# EasyEDA Pro project ProDoc_pico-mac v2.0.epro

# Schematic pico-mac v2.0
Board Name: pico-mac v2.0; Create Date: 2025-06-08; Page Name: schematic; Project Name: pico-mac; Schematic Name: pico-mac v2.0; Update Date: 2025-06-14; Add into BOM: yes; Convert to PCB: yes; Date: 2025-05-04; Draw By: moepunch123; REV: 1.0; Sheet: 1/1; spicePre: .
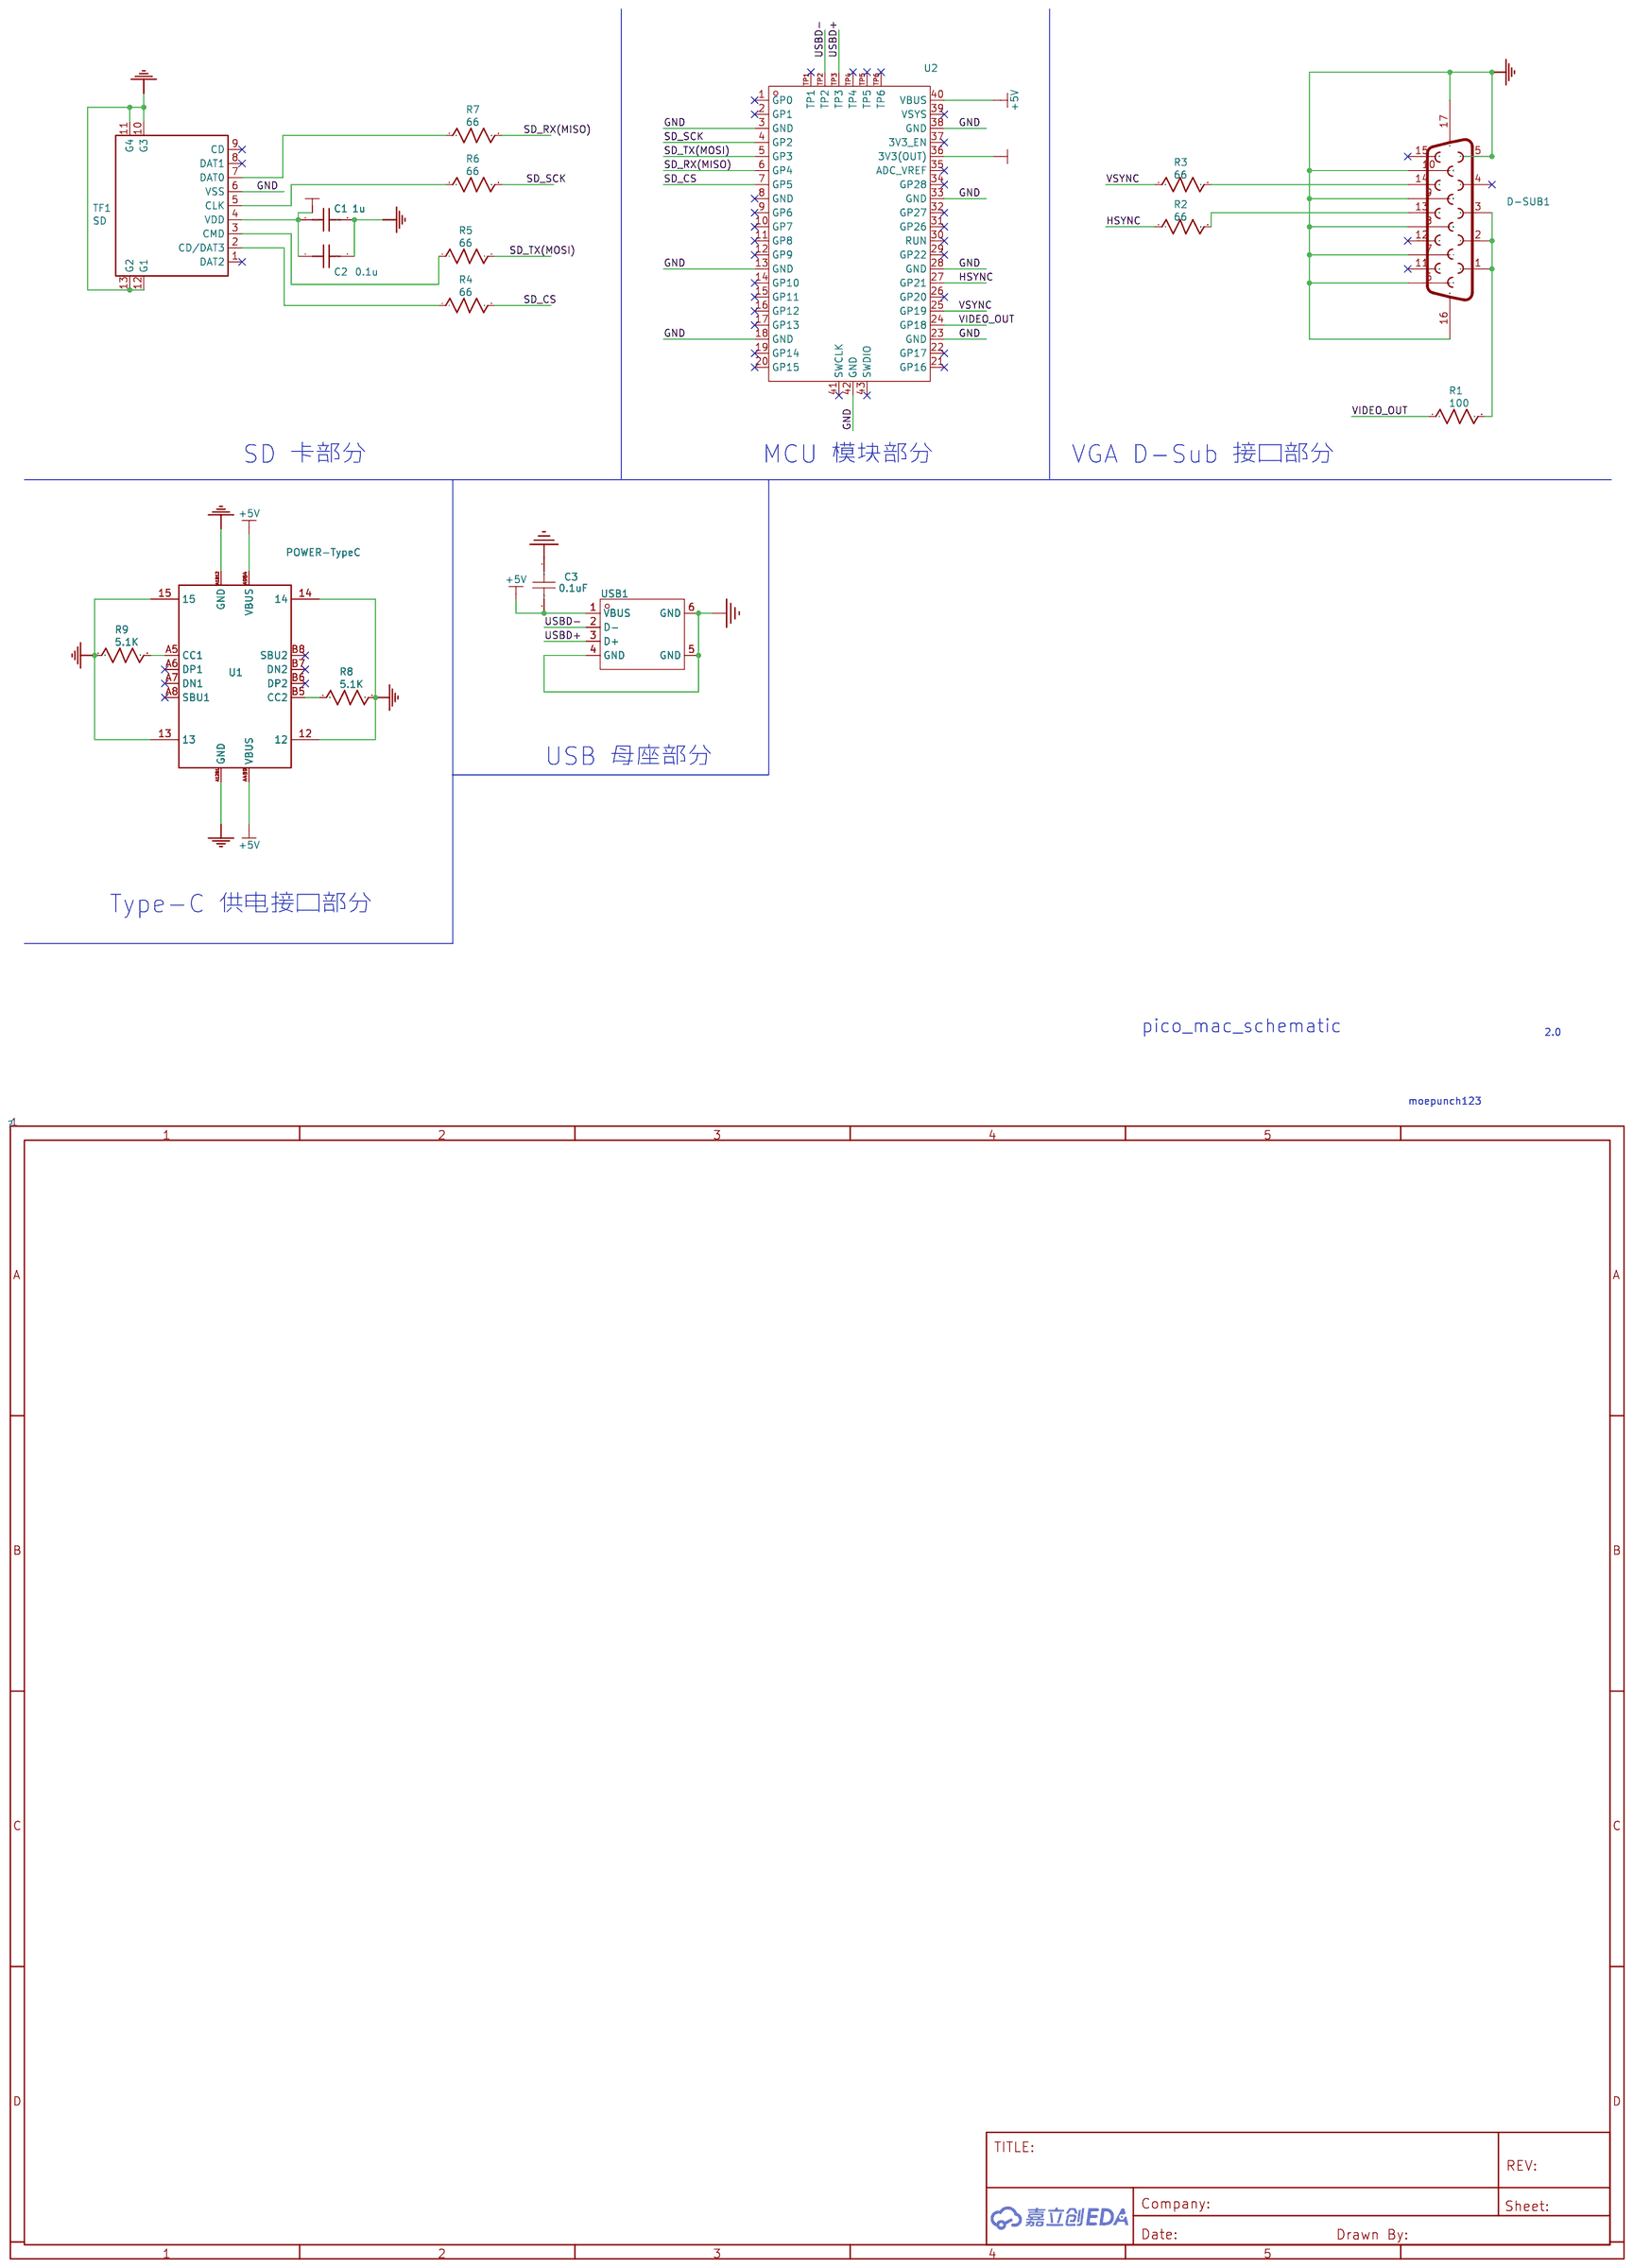
[diagram p0: schematic sheet]

## Parts
C1  1u  [C0603]
C2  0.1u  [C0603]
C3  0.1uF  [C0603]
D-SUB1  VGA  [DSUB-TH_KH-HDR15P-F3.08-VGA]
R1  100  [R0603]
R2  66  [R0603]
R3  66  [R0603]
R4  66  [R0603]
R5  66  [R0603]
R6  66  [R0603]
R7  66  [R0603]
R8  5.1K  [R0603]
R9  5.1K  [R0603]
TF1  SD  [TF-SMD_TF-15-15]
U1  POWER-TypeC  [USB-C-SMD_HC-TYPE-C-16P-026W]
U2  PICO  [COMM-SMD_L51.0-W21.0-P2.54_SC0916]
USB1  USB-231-ARY  [USB-A-TH_USB-231-ARY]

## Library data of the parts
C1 = 1u: nameAlias: Value(F); Contributor: LCEDA_Lib; spicePre: C; spiceSymbolName: C_0603_US
C2 = 0.1u: nameAlias: Value(F); Contributor: LCEDA_Lib; spicePre: C; spiceSymbolName: C_0603_US
C3 = CAP_0603: Supplier Footprint: 0603
D-SUB1 = VGA: Supplier: LCSC; Supplier Part: C3038673; Manufacturer: kinghelm(金航标); Manufacturer Part: KH-HDR15P-F3.08; Contributor: lcsc; spicePre: C; spiceSymbolName: KH-HDR15P-F3.08
R1 = 100: nameAlias: Value(Ω); Contributor: LCEDA_Lib; spicePre: R; spiceSymbolName: R_0603_US
R2-R7 = 66: nameAlias: Value(Ω); Contributor: LCEDA_Lib; spicePre: R; spiceSymbolName: R_0603_US
R8 R9 = 5.1K: nameAlias: Value(Ω); Contributor: LCEDA_Lib; spicePre: R; spiceSymbolName: R_0603_US
TF1 = SD: Supplier: LCSC; Supplier Part: C9900023771; Manufacturer: null; JLCPCB Part Class: Extended Part; Contributor: lcsc; spicePre: T
U1 = POWER-TypeC: Supplier: LCSC; Supplier Part: C19274016; Manufacturer: HC(虹成电子); Manufacturer Part: HC-TYPE-C-16P-3M2S; JLCPCB Part Class: Extended Part; Contributor: lcsc; spicePre: U; spiceSymbolName: HC-TYPE-C-16P-3M2S
U2 = PICO: "基于Raspberry Pi RP2040芯片设计；处理器：双核Arm Cortex-M0+ @ 133MHz内存：264KB片上SRAM；2MB板上QSPI闪存接口：26个GPIO引脚，包括3个模拟输入；2 × UART；2 × SPI控制器；2 × I2C控制器；16个PWM通道；1 × USB 1.1控制器和PHY，支持主机和设备；8 × PIO状态机"; Supplier Part: C7203002; Manufacturer: Raspberry Pi(树莓派); JLCPCB Part Class: 扩展库; Datasheet: https://atta.szlcsc.com/upload/public/pdf/source/20230906/086376002DDC9866828648BC93E51F8B.pdf; Supplier: LCSC
USB1 = USB-231-ARY: 连接器类型:Type-A;标准:USB 2.0;公母:母;端口数量:1;触点数量:4P;安装方式:弯插;额定电流 - 电源:1.5A;触头材质:-;触头镀层:-;工作温度范围:-20℃~+70℃;焊接温度(最大值):260℃;; LCSC Part Name: Type-A 母 弯插; Supplier Part: C720525; Manufacturer: XUNPU(讯普); Supplier Footprint: 插件; JLCPCB Part Class: 扩展库; Datasheet: https://atta.szlcsc.com/upload/public/pdf/source/20200810/C720525_A4C9C15D608FF9239C9C137FD959DB52.pdf; Supplier: LCSC; Connector Type: Type-A; Standard: USB 2.0; Gender: 母; Number of Ports: 1; Number of Contacts: 4P; Mounting Style: 弯插; Current Rating - Power (Max): 1.5A; Operating Temperature Range: -20℃~+70℃; Soldering Temperature(Max): 260℃

## Nets
+3.3V: C1.1 C2.1 TF1.4(VDD) U2.36(3V3(OUT))
+5V: C3.2 U1.A4B9(VBUS) U1.A9B4(VBUS) U2.40(VBUS) USB1.1(VBUS)
GND: C1.2 C2.2 C3.1 D-SUB1.5 D-SUB1.6 D-SUB1.7 D-SUB1.8 D-SUB1.9 D-SUB1.10 D-SUB1.16 D-SUB1.17 R8.2 R9.1 TF1.6(VSS) TF1.10(G3) TF1.11(G4) TF1.12(G1) TF1.13(G2) U1.12 U1.13 U1.14 U1.15 U1.A1B12(GND) U1.A12B1(GND) U2.3(GND) U2.13(GND) U2.18(GND) U2.23(GND) U2.28(GND) U2.33(GND) U2.38(GND) U2.42(GND) USB1.4(GND) USB1.5(GND) USB1.6(GND)
HSYNC: R2.1 U2.27(GP21)
SD_CS: R4.2 U2.7(GP5)
SD_RX(MISO): R7.2 U2.6(GP4)
SD_SCK: R6.2 U2.4(GP2)
SD_TX(MOSI): R5.2 U2.5(GP3)
USBD+: U2.TP3 USB1.3(D+)
USBD-: U2.TP2 USB1.2(D-)
VIDEO_OUT: R1.1 U2.24(GP18)
VSYNC: R3.1 U2.25(GP19)
$1N2: D-SUB1.1 D-SUB1.2 D-SUB1.3 R1.2
$1N4: D-SUB1.14 R3.2
$1N6: D-SUB1.13 R2.2
$1N12: R6.1 TF1.5(CLK)
$1N15: R5.1 TF1.3(CMD)
$1N17: R4.1 TF1.2(CD/DAT3)
$1N22: R9.2 U1.A5(CC1)
$1N23: R8.1 U1.B5(CC2)
$1N3252: R7.1 TF1.7(DAT0)

Not connected (* = marked no-connect by the designer): D-SUB1 4* 11* 12* 15*; TF1 1(DAT2)* 8(DAT1)* 9(CD)*; U1 A6(DP1)* A7(DN1)* A8(SBU1)* B6(DP2)* B7(DN2)* B8(SBU2)*; U2 1(GP0)* 2(GP1)* 8(GND)* 9(GP6)* 10(GP7)* 11(GP8)* 12(GP9)* 14(GP10)* 15(GP11)* 16(GP12)* 17(GP13)* 19(GP14)* 20(GP15)* 21(GP16)* 22(GP17)* 26(GP20)* 29(GP22)* 30(RUN)* 31(GP26)* 32(GP27)* 34(GP28)* 35(ADC_VREF)* 37(3V3_EN)* 39(VSYS)* 41(SWCLK)* 43(SWDIO)* TP1* TP4* TP5* TP6*

## Notes on the sheet
- SD 卡部分
- MCU 模块部分
- VGA D-Sub 接口部分
- USB 母座部分
- Type-C 供电接口部分
- pico_mac_schematic
- 2.0
- moepunch123

# Board PCB_pico-mac_v2.0
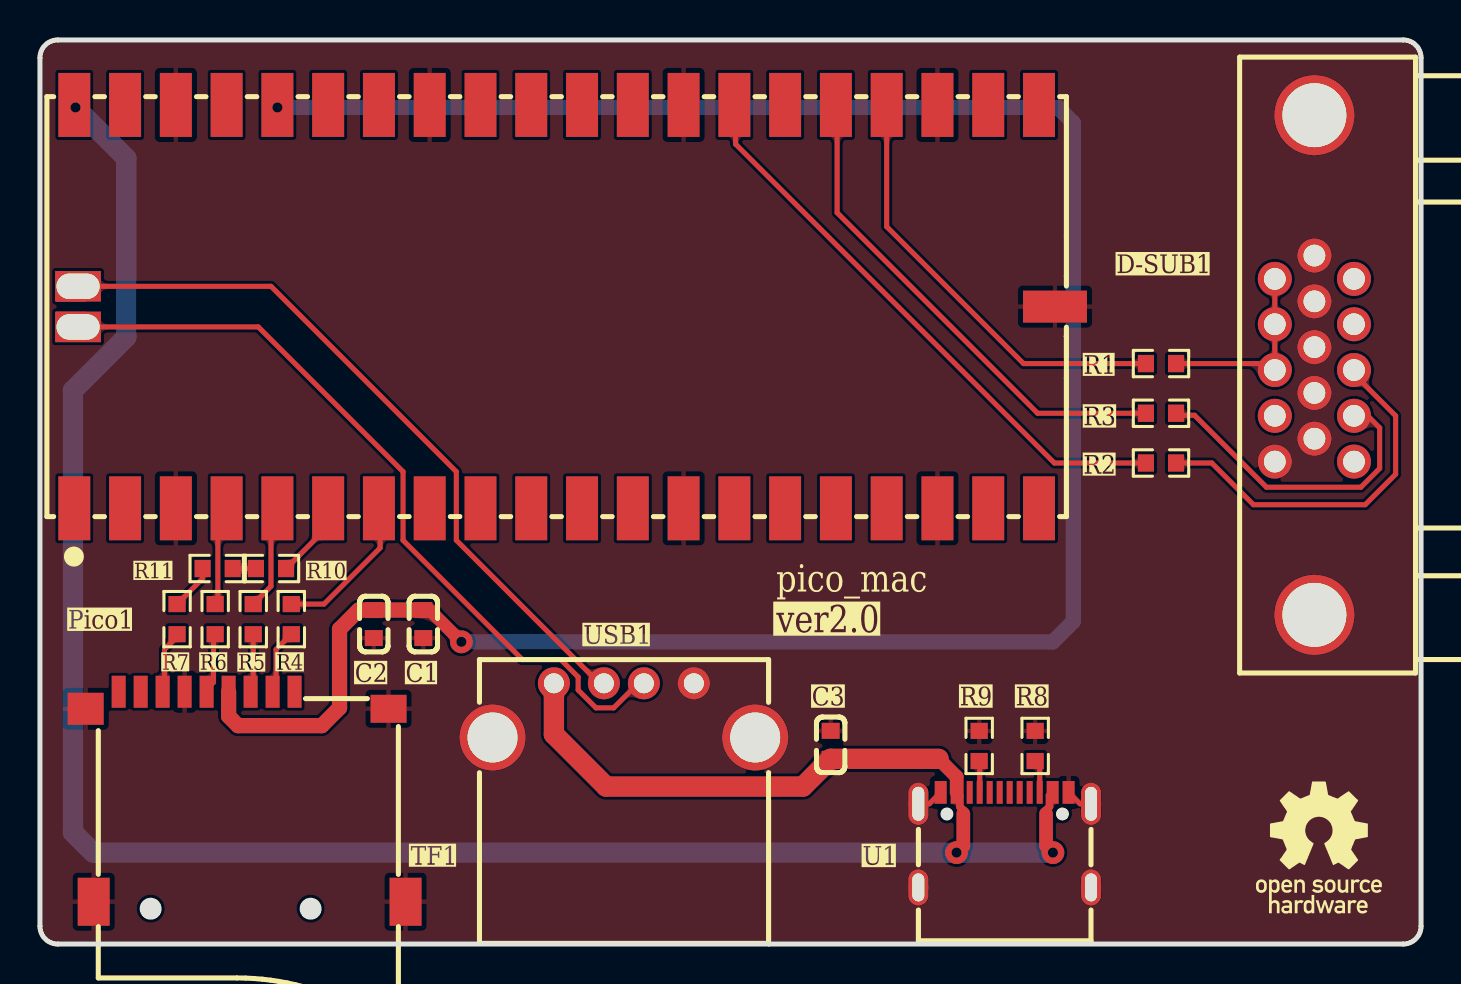
[diagram p1: board, top side]
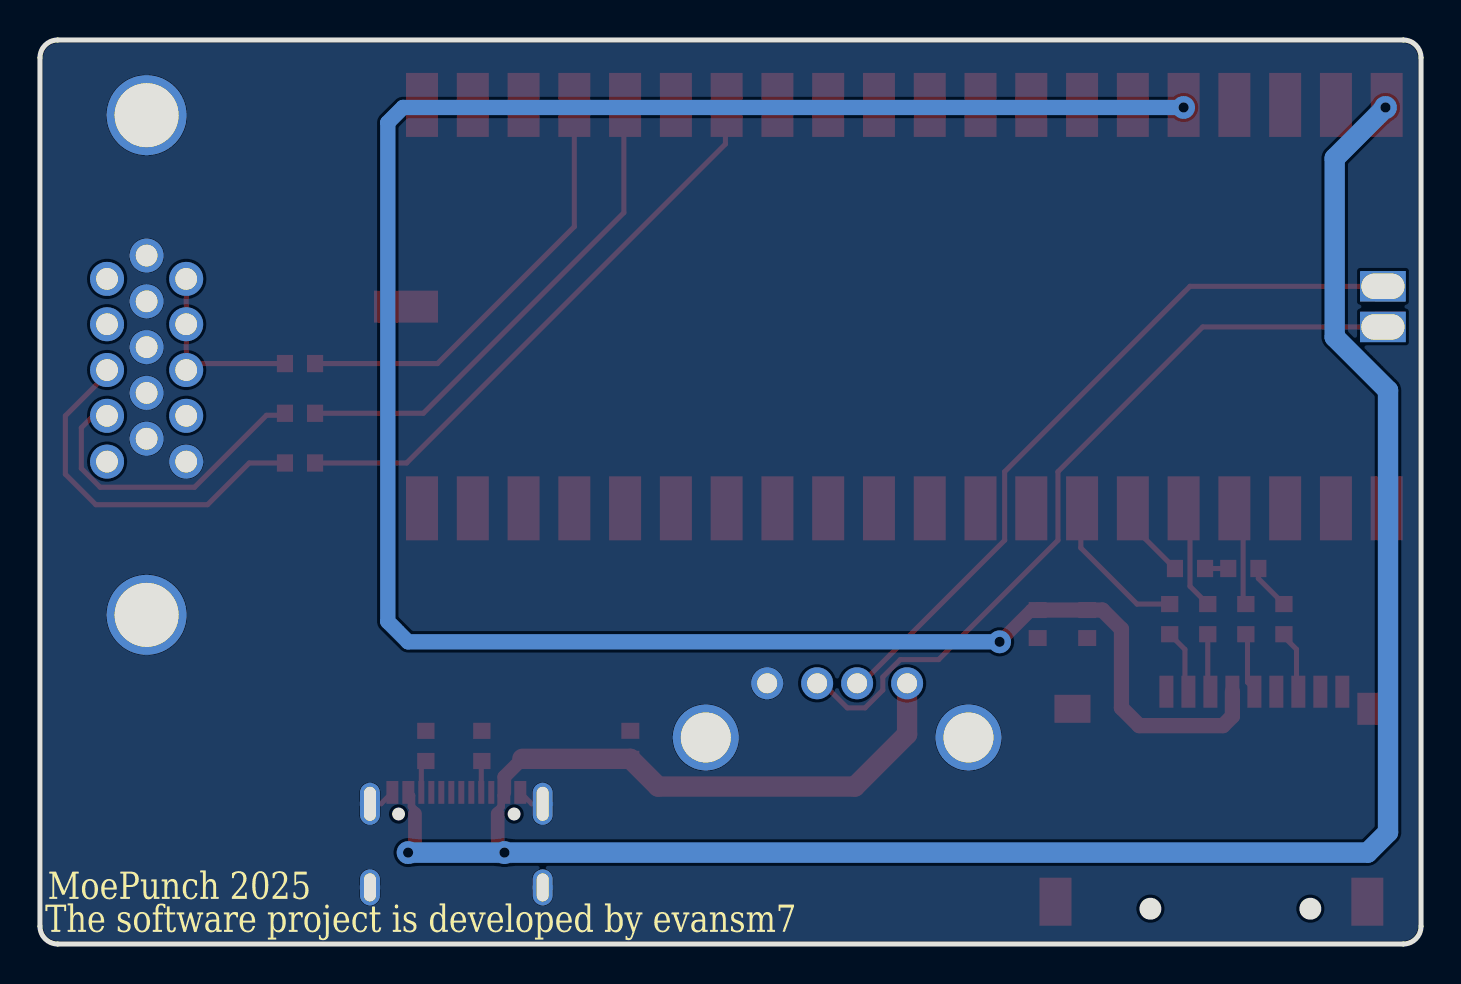
[diagram p2: board, bottom side, seen from below]

Outline 69.09 x 45.21 mm; copper layers: Top Layer, Bottom Layer. Coordinates in mm from the lower left corner of the outline.
Outline path: 0,44.32 0,0.89 arc(0.26,0.26) 0.89,0 68.2,0 arc(68.83,0.26) 69.09,0.89 69.09,44.32 arc(68.83,44.95) 68.2,45.21 0.89,45.21 arc(0.26,44.95) 0,44.32
Stack: Top Layer 0.035mm / Dielectric1 1.51mm FR4 er 4.5 / Bottom Layer 0.035mm

## Design rules (mm)
spacing Default (default): track to track 0.152, other pairs 0 to 0.152
track width Default (default): min 0.254, default 0.254, max 25.4
differential pair differentialPair (default): width min 0.127, default 0.254, max 2.54; gap min 0.152, default 0.152
via Default (default): diameter min 0.61, default 0.61, max 100.025; hole min 0.305, default 0.305, max 59.995

## Placement (name value [footprint] x y rotation side)
C1  1u  [C0603]  19.18 16 270 top
C2  0.1u  [C0603]  16.7 16 270 top
C3  0.1uF  [C0603]  39.55 9.96 270 top
D-SUB1  VGA  [DSUB-TH_KH-HDR15P-F3.08-VGA]  63.75 28.96 90 top
NOREF  -  [Pad_e638]  1.91 30.86 0 top
NOREF#2  -  [Pad_e636]  1.91 32.89 0 top
Pico1  PICO  [COMM-SMD_L51.0-W21.0-P2.54_SC0916]  26.16 31.88 0 top
R1  100  [R0603]  56.08 29.03 0 top
R2  66  [R0603]  56.08 24.06 0 top
R3  66  [R0603]  56.08 26.54 0 top
R4  66  [R0603]  12.57 16.25 90 top
R5  66  [R0603]  10.67 16.25 90 top
R6  66  [R0603]  8.76 16.25 90 top
R7  66  [R0603]  6.86 16.25 90 top
R8  5.1K  [R0603]  49.78 9.91 90 top
R9  5.1K  [R0603]  46.98 9.91 270 top
R10  10K  [R0603]  11.56 18.78 0 top
R11  10K  [R0603]  8.89 18.78 0 top
TF1  SD  [TF-SMD_TF-15-15]  10.29 7.37 270 top
U1  POWER-TypeC  [USB-C-SMD_HC-TYPE-C-16P-026W]  48.26 5.21 0 top
USB1  USB-231-ARY  [USB-A-TH_USB-231-ARY]  29.21 11.68 0 top

## Footprints (pads in the part's own frame, mm; a bottom-side part is the same pattern mirrored in y, then rotated)
C0603
  rect 0.8x0.9 smd: 1(-0.7,0) 2(0.7,0)
COMM-SMD_L51.0-W21.0-P2.54_SC0916
  rect 1.6x3.2 smd: 1(-24.445,-10.088) 2(-21.905,-10.088) 3(-19.365,-10.088) 4(-16.825,-10.088) 5(-14.285,-10.088) 6(-11.745,-10.088) 7(-9.205,-10.088) 8(-6.665,-10.088) 9(-4.125,-10.088) 10(-1.585,-10.088) 11(0.955,-10.088) 12(3.495,-10.088) 13(6.035,-10.088) 14(8.575,-10.088) 15(11.115,-10.088) 16(13.655,-10.088) 17(16.195,-10.088) 18(18.735,-10.088) 19(21.275,-10.088) 20(23.815,-10.088) 21(23.815,10.088) 22(21.275,10.088) 23(18.735,10.088) 24(16.195,10.088) 25(13.655,10.088) 26(11.115,10.088) 27(8.575,10.088) 28(6.035,10.088) 29(3.495,10.088) 30(0.955,10.088) 31(-1.585,10.088) 32(-4.125,10.088) 33(-6.665,10.088) 34(-9.205,10.088) 35(-11.745,10.088) 36(-14.285,10.088) 37(-16.825,10.088) 38(-19.365,10.088) 39(-21.905,10.088) 40(-24.445,10.088)
  rect 3.2x1.6 smd: 42(24.615,0)
  rect 1.5x1.5 smd: TP2(-24.615,1) TP3(-24.615,-1)
DSUB-TH_KH-HDR15P-F3.08-VGA
  round 1.7 hole 1.09: 1(4.308,1.98) 2(2.04,1.98) 3(-0.25,1.98) 4(-2.54,1.98) 5(-4.83,1.98) 6(5.475,0) 7(3.185,0) 8(0.895,0) 9(-1.395,0) 10(-3.685,0) 11(4.308,-1.98) 12(2.04,-1.98) 13(-0.25,-1.98) 14(-2.54,-1.98) 15(-4.83,-1.98)
  round 4 hole 3.2: 16(12.495,0) 17(-12.495,0)
Pad_e636
  rect 2.286x1.524 hole 2.159x1.27: 1(0,0)
Pad_e638
  rect 2.286x1.524 hole 2.159x1.27: 1(0,0)
R0603
  rect 0.806x0.864 smd: 1(-0.753,0) 2(0.753,0)
TF-SMD_TF-15-15
  rect 1.6x0.701 smd: 1(-5.252,2.45) 2(-5.252,1.35) 3(-5.252,0.25) 4(-5.252,-0.85) 5(-5.252,-1.95) 6(-5.252,-3.05) 7(-5.252,-4.15) 8(-5.252,-5.25) 9(-5.252,-6.35)
  rect 1.6x1.8 smd: 10(-4.399,-8)
  rect 2.4x1.6 smd: 11(5.252,-7.6) 12(5.252,8)
  rect 1.399x1.801 smd: 13(-4.398,7.151)
USB-A-TH_USB-231-ARY
  round 1.6 hole 1: 1(-3.5,1.355) 2(-1,1.355) 3(1,1.355) 4(3.5,1.355)
  round 3.3 hole 2.5: 5(-6.57,-1.355) 6(6.57,-1.355)
USB-C-SMD_HC-TYPE-C-16P-026W
  oval 1x2.1 hole 0.6x1.7: 12(-4.32,1.805) 13(4.32,1.805)
  oval 1x1.8 hole 0.6x1.4: 14(-4.32,-2.375) 15(4.32,-2.375)
  rect 0.6x1.14 smd: A1B12(-3.2,2.375) A4B9(-2.4,2.375) A9B4(2.4,2.375) A12B1(3.2,2.375)
  rect 0.3x1.14 smd: A5(-1.25,2.375) A6(-0.249,2.375) A7(0.25,2.375) A8(1.25,2.375) B5(1.75,2.375) B6(0.75,2.375) B7(-0.75,2.375) B8(-1.75,2.375)

## Nets
+3.3V: C1.1 C2.1 Pico1.36 TF1.4
+5V: C3.2 Pico1.40 U1.A4B9 U1.A9B4 USB1.1
GND: C1.2 C2.2 C3.1 D-SUB1.5 D-SUB1.6 D-SUB1.7 D-SUB1.8 D-SUB1.9 D-SUB1.10 D-SUB1.16 D-SUB1.17 Pico1.3 Pico1.13 Pico1.18 Pico1.23 Pico1.28 Pico1.33 Pico1.38 Pico1.42 R8.2 R9.1 TF1.6 TF1.10 TF1.11 TF1.12 TF1.13 U1.12 U1.13 U1.14 U1.15 U1.A1B12 U1.A12B1 USB1.4 USB1.5 USB1.6
HSYNC: Pico1.27 R2.1
SD_CS: Pico1.7 R4.2
SD_RX(MISO): Pico1.6 R7.2 R10.1 R10.2 R11.1 R11.2
SD_SCK: Pico1.4 R6.2
SD_TX(MOSI): Pico1.5 R5.2
USBD+: NOREF.1 Pico1.TP3 USB1.3
USBD-: NOREF#2.1 Pico1.TP2 USB1.2
VIDEO_OUT: Pico1.24 R1.1
VSYNC: Pico1.25 R3.1
$1N2: D-SUB1.1 D-SUB1.2 D-SUB1.3 R1.2
$1N4: D-SUB1.14 R3.2
$1N6: D-SUB1.13 R2.2
$1N12: R6.1 TF1.5
$1N15: R5.1 TF1.3
$1N17: R4.1 TF1.2
$1N22: R9.2 U1.A5
$1N23: R8.1 U1.B5
$1N3252: R7.1 TF1.7

Pads without a net: D-SUB1 4 11 12 15; Pico1 1 2 8 9 10 11 12 14 15 16 17 19 20 21 22 26 29 30 31 32 34 35 37 39; TF1 1 8 9; U1 A6 A7 A8 B6 B7 B8

## Via types
v1: diameter 1.143, hole 0.508, Top Layer to Bottom Layer, 5 vias

## Routing (per net, layer and track width the routed paths; a pad name or vN(x,y) marks a point on that pad's centre or on a via; arc(x,y) is an arc through that point)
+3.3V: length 114.5
  Top Layer w0.635: v1(21.08,15.11) 19.49,16.7 C1.1
  Top Layer w0.762: TF1.4 9.44,11.39 9.91,10.92 14.1,10.92 14.99,11.81 14.99,15.75 15.94,16.7 C2.1 C1.1
  Bottom Layer w0.762: v1(21.08,15.11) 50.67,15.11 51.69,16.13 51.69,41.08 50.93,41.84 v1(11.88,41.84)
+5V: length 119.9
  Top Layer w0.381: 46.19,6.52 46.19,6.7 46.02,6.87 46.02,7.42 U1.A4B9 ; 50.66,7.58 50.5,7.42 50.5,6.87 50.33,6.7 50.33,6.52
  Top Layer w0.686: 50.33,6.52 50.33,4.92 v1(50.67,4.57) ; U1.A4B9 45.86,8.36 44.95,9.26 ; 46.19,6.52 46.19,4.91 v1(45.85,4.57)
  Top Layer w1.016: USB1.1 25.71,10.49 28.32,7.87 38.17,7.87 C3.2 44.95,9.26
  Bottom Layer w1.016: v1(50.67,4.57) v1(45.85,4.57) 2.67,4.57 1.65,5.59 1.65,27.69 4.32,30.35 4.32,39.3 v1(1.78,41.84)
GND: length 2.7
  Top Layer w0.254: 45.06,7.58 44.49,7.01 43.94,7.01 ; U1.A12B1 52.03,7.01 U1.13
HSYNC: length 29.1
  Top Layer w0.254: Pico1.27 34.8,41.9 34.8,40.01 50.75,24.06 R2.1
SD_CS: length 7.6
  Top Layer w0.254: R4.2 14.21,17 17.02,19.81 17.02,21.73 Pico1.7
SD_RX(MISO): length 7.4
  Top Layer w0.254: R11.2 R10.1 ; R11.1 8.14,18.28 R7.2 ; R10.2 14.42,20.89 Pico1.6
SD_SCK: length 5
  Top Layer w0.254: Pico1.4 8.9,21.35 8.9,17
SD_TX(MOSI): length 5.3
  Top Layer w0.254: R5.2 11.56,17.89 11.56,21.47 Pico1.5
USBD+: length 39.1
  Top Layer w0.254: USB1.3 29.93,13.04 28.7,11.81 27.81,11.81 26.92,12.7 26.92,13.35 26.05,14.22 24.13,14.22 18.16,20.19 18.16,23.62 10.92,30.86 NOREF.1
USBD-: length 36.5
  Top Layer w0.254: NOREF#2.1 11.56,32.89 20.83,23.62 20.83,20.19 27.98,13.04 USB1.2
VIDEO_OUT: length 21.9
  Top Layer w0.254: R1.1 49.2,29.03 42.36,35.88 Pico1.24
VSYNC: length 25.1
  Top Layer w0.254: 55.33,26.28 55.06,26.54 49.91,26.54 39.88,36.58 39.88,41.9 Pico1.25
$1N2: length 9.6
  Top Layer w0.254: R1.2 61.45,29.03 D-SUB1.3 D-SUB1.1
$1N4: length 15.8
  Top Layer w0.254: D-SUB1.14 65.9,26.58 66.26,26.58 67.02,25.82 67.02,23.79 66.08,22.84 61.36,22.84 57.76,26.44 57,26.44 56.83,26.28
$1N6: length 18.6
  Top Layer w0.254: R2.2 58.62,24.06 60.71,21.97 66.29,21.97 67.82,23.5 67.82,26.42 65.73,28.5 D-SUB1.13
$1N12: length 3.2
  Top Layer w0.254: 8.9,15.49 8.77,15.49 8.68,15.4 8.68,13.09 8.34,12.74 TF1.5
$1N15: length 2.9
  Top Layer w0.254: TF1.3 10.67,12.75 R5.1
$1N17: length 3.3
  Top Layer w0.254: TF1.2 11.81,12.79 11.81,14.73 R4.1
$1N22: length 1.6
  Top Layer w0.254: U1.A5 47.01,9.13 R9.2
$1N23: length 1.7
  Top Layer w0.254: U1.B5 50.01,8.93 R8.1
$1N3252: length 3.2
  Top Layer w0.254: R7.1 6.86,15.37 6.23,14.74 6.23,12.71 TF1.7

## Copper pours and planes (outline as drawn; the poured copper is in the pictures)
GND on Top Layer: -2.54,46.48 70.48,46.48 70.48,-4.32 -2.54,-4.32
GND on Top Layer: -2.79,46.48 70.36,46.48 70.36,-4.44 -2.79,-4.44
GND on Bottom Layer: -2.79,46.48 70.36,46.48 70.36,-4.32 -2.79,-4.32

Small or netless copper shapes (teardrops, artwork), in the pictures only: 59 on Top Layer, 6 on Bottom Layer

## Text on the board
Bottom Silkscreen Layer: MoePunch 2025 | The software project is developed by evansm7
Top Silkscreen Layer: pico_mac | ver2.0
